# Altium schematic sheet PFC.SchDoc
size A4
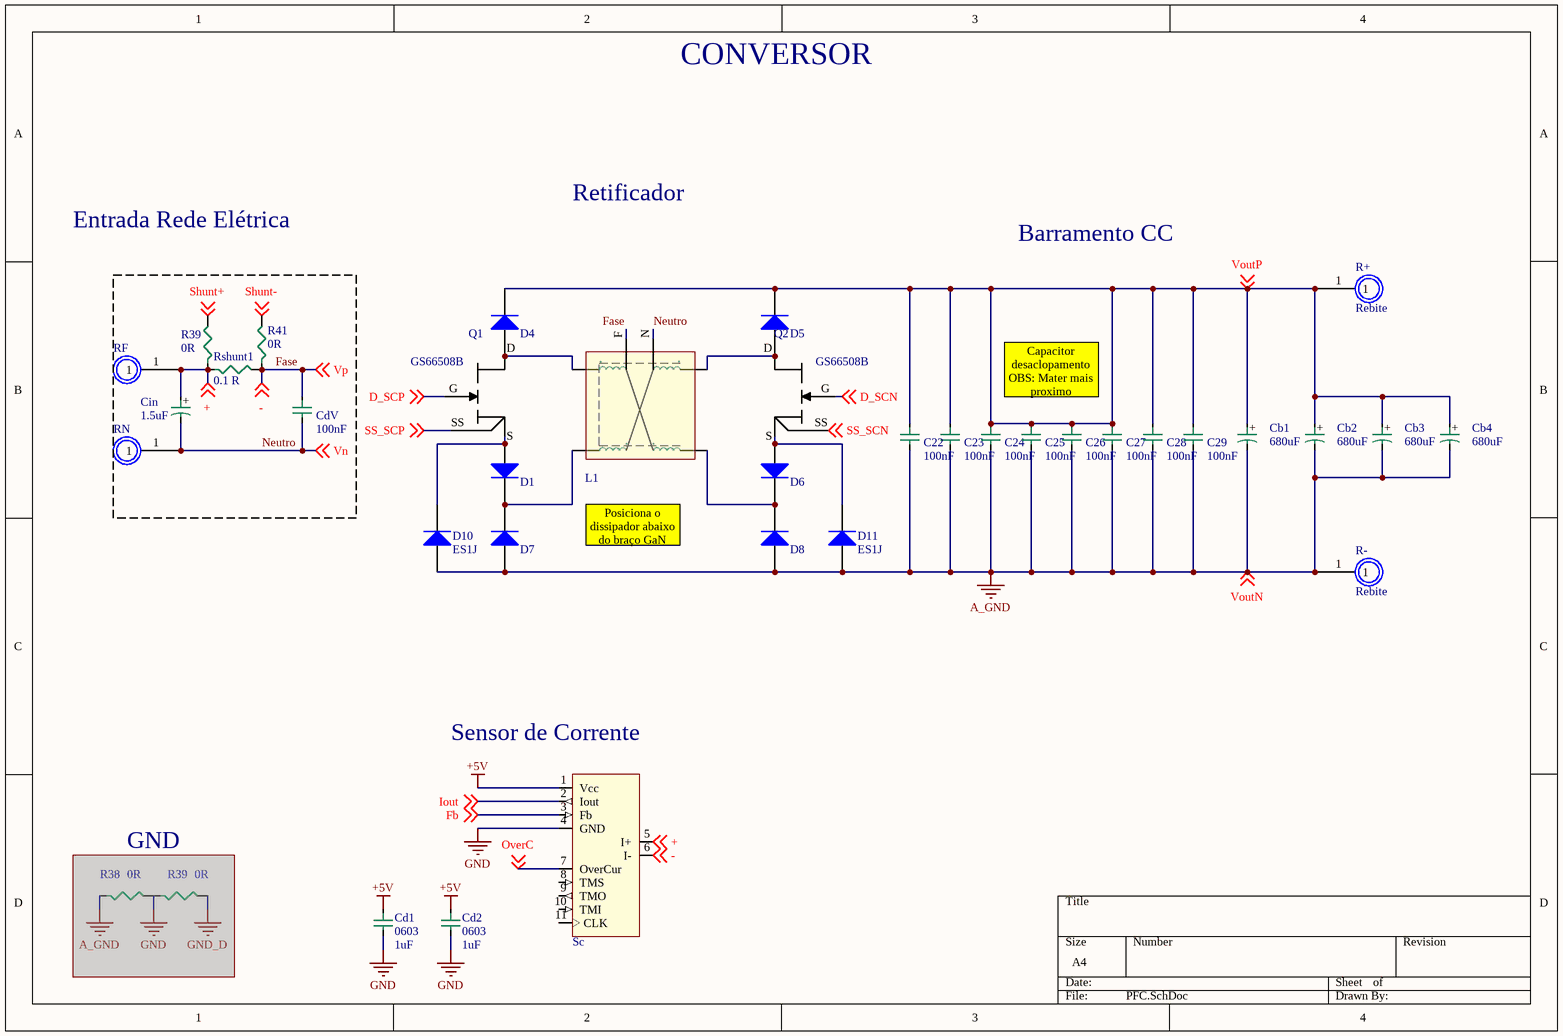
[diagram p0: PFC.SchDoc]

## Parts
(Parts that share a designator on the sheet are numbered #1, #2 ... from top to bottom, then left to right.)
C22  value 100nF  [1812C]  (hidden comment: 1812)
C23  value 100nF  [1812C]  (hidden comment: 1812)
C24  value 100nF  [1812C]  (hidden comment: 1812)
C25  value 100nF  [1812C]  (hidden comment: 1812)
C26  value 100nF  [1812C]  (hidden comment: 1812)
C27  value 100nF  [1812C]  (hidden comment: 1812)
C28  value 100nF  [1812C]  (hidden comment: 1812)
C29  value 100nF  [1812C]  (hidden comment: 1812)
Cb1  value 680uF  [CAP ALU D30 A50  DeitadoPCB]  (hidden comment: Cap 30x50 mm)
Cb2  value 680uF  [CAP ALU D30 A50  DeitadoPCBV]  (hidden comment: Cap 30x50 mm)
Cb3  value 680uF  [CAP ALU D30 A50  DeitadoPCB]  (hidden comment: Cap 30x50 mm)
Cb4  value 680uF  [CAP ALU D30 A50  DeitadoPCBV]  (hidden comment: Cap 30x50 mm)
Cd1  0603  value 1uF  [0603C]
Cd2  0603  value 1uF  [0603C]
CdV  value 100nF  [1812C]  (hidden comment: 1812)
Cin  value 1.5uF  [CAP FILM 22.5 mm Lead]  (hidden comment: Cap Film 22.5mm)
D1  IDL12G65C5XUMA2Diode 1N40XX  [VSON4]  (value not drawn)
D4  IDL12G65C5XUMA2Diode 1N40XX  [VSON4]  (value not drawn)
D5  IDL12G65C5XUMA2Diode 1N40XX  [VSON4]  (value not drawn)
D6  IDL12G65C5XUMA2Diode 1N40XX  [VSON4]  (value not drawn)
D7  IDL12G65C5XUMA2Diode 1N40XX  [VSON4]  (value not drawn)
D8  IDL12G65C5XUMA2Diode 1N40XX  [VSON4]  (value not drawn)
D10  ES1J  [DO-214AC]
D11  ES1J  [DO-214AC]
L1  Indutor PFC Dissertacao  [INDUTOR DISSERTACAO]  (value not drawn)
Q1  GS66508B  [GS66508B]
Q2  GS66508B  [GS66508B]
R38  value 0R  [0805]  (hidden comment: 0805)  (masked out: inside a compile mask, not in the netlist)
R39#1  value 0R  [0603]  (hidden comment: 0603)
R39#2  value 0R  [0805]  (hidden comment: 0805)  (masked out: inside a compile mask, not in the netlist)
R41  value 0R  [0603]  (hidden comment: 0603)
R+  Rebite  [Rebite]
R-  Rebite  [Rebite]
RF  Rebite  [Rebite]  (value not drawn)
RN  Rebite  [Rebite]  (value not drawn)
Rshunt1  value 0.1 R  [WSHM]  (hidden comment: WSHM28189L000FEA)
Sc  Sensor Corrente Diss CFS1000  [Sensor Corrente Diss CFS1000]  (value not drawn)

## Nets
+5V: Cd1.1 Cd2.1 Sc.1(Vcc)
A_GND: C22.2 C23.2 C24.2 C25.2 C26.2 C27.2 C28.2 C29.2 Cb1.2 Cb2.2 Cb3.2 Cb4.2 D7.1(A) D8.1(A) D10.1(A) D11.1(A) R-.1 ; off-sheet VoutN  [also labelled VoutN]
GND: Cd1.2 Cd2.2 Sc.4(GND)
+: Cin.1 R39#1.1 RF.1 Rshunt1.1 Sc.5(I+) ; off-sheet +
D_SCN: Q2.G ; off-sheet D_SCN
D_SCP: Q1.G ; off-sheet D_SCP
Fase: CdV.1 L1.F R41.1 Rshunt1.2 Sc.6(I-) ; off-sheet Vp, off-sheet -  [also labelled -, Vp]
Fb: Sc.3(Fb) ; off-sheet Fb
Iout: Sc.2(Iout) ; off-sheet Iout
Neutro: CdV.2 Cin.2 L1.N RN.1 ; off-sheet Vn  [also labelled Vn]
OverC: Sc.7(OverCur) ; off-sheet OverC
Shunt+: R39#1.2 ; off-sheet Shunt+
Shunt-: R41.2 ; off-sheet Shunt-
SS_SCN: Q2.SS ; off-sheet SS_SCN
SS_SCP: Q1.SS ; off-sheet SS_SCP
VoutP: C22.1 C23.1 C24.1 C25.1 C26.1 C27.1 C28.1 C29.1 Cb1.1 Cb2.1 Cb3.1 Cb4.1 D4.2(K) D5.2(K) R+.1 ; off-sheet VoutP
NetD1_1: D1.1(A) D10.2(K) Q1.S
NetD1_2: D1.2(K) D7.2(K) L1.2
NetD4_1: D4.1(A) L1.1 Q1.D
NetD5_1: D5.1(A) L1.3 Q2.D
NetD6_1: D6.1(A) D11.2(K) Q2.S
NetD6_2: D6.2(K) D8.2(K) L1.4

Not connected (* = marked no-connect by the designer): Sc 8(TMS) 9(TMO) 10(TMI) 11(CLK)

## Notes on the sheet
- CONVERSOR
- Entrada Rede Elétrica
- Retificador
- Barramento CC
- Capacitor desaclopamento
  OBS: Mater mais proximo
  do braço do conversor.
- Posiciona o dissipador abaixo do braço GaN
- (near Sc) Sensor de Corrente
- GND
- (in symbol Capacitor ALU 30x50 mm) +
- (in symbol Capacitor FILM 22.5mm) +

## Library data of the parts
C22-C29 CdV = Capacitor SMD 1812
Cb1-Cb4 = Capacitor ALU 30x50 mm: Capacitor 30x50 mm; %: ±20%; Tensão: 200V
Cd1 Cd2 = Capacitor SMD 0603
Cin = Capacitor FILM 22.5mm: Film Capacitors 310volts 1.5uF 10%; %: ±20%; Tensão: 200V; ComponentLink1Description: Mouser; ComponentLink1URL: https://br.mouser.com/ProductDetail/80-F863DV155M310L
D1 D4-D8 = IDL12G65C5XUMA2: DIODE SCHOTTKY 650V 12A VSON-4; ComponentLink1Description: DIGI; ComponentLink1URL: https://www.digikey.com/product-detail/en/infineon-technologies/IDL12G65C5XUMA2/IDL12G65C5XUMA2-ND/7313875
D10 D11 = Diode ES1J: Rectifiers 1.0 A Ultra Fast Recovery Rect; ComponentLink1Description: MOUSER; ComponentLink1URL: https://br.mouser.com/ProductDetail/512-ES1J; ComponentLink2Description: DATASHEET; ComponentLink2URL: https://br.mouser.com/datasheet/2/308/ES1J-D-1804952.pdf
L1 = Indutor PFC Dissertacao: Indutor; Value: 32uH
Q1 Q2 = GS66508B: GAN TRANS E-MODE 650V 30A
R38 R39#2 = Resistor SMD 0805 1/8 W: %: ±1%; P: 1/8W
R39#1 R41 = Resistor SMD 0603 1/10 W: %: ±1%; P: 1/8W
Rshunt1 = Resistor shunt SMD 7 W: 7W Chip Resistor Nonstandard Automotive AEC-Q200, Current Sense, Moisture Resistant, Pulse Withstanding Metal Element; %: ±1%; P: 3W
Sc = Sensor Corrente Diss CFS1000: Sensor Corrente Dissertação CFS1000